# EasyEDA schematic SCH_WROBD 2022_2022-09-23.json
TITLE: Team Prodigy Schematics; REV: 1.0; Date: 2022-09-22; Sheet: 1/1; Drawn By: Tausif Samin; Company: Team Prodigy
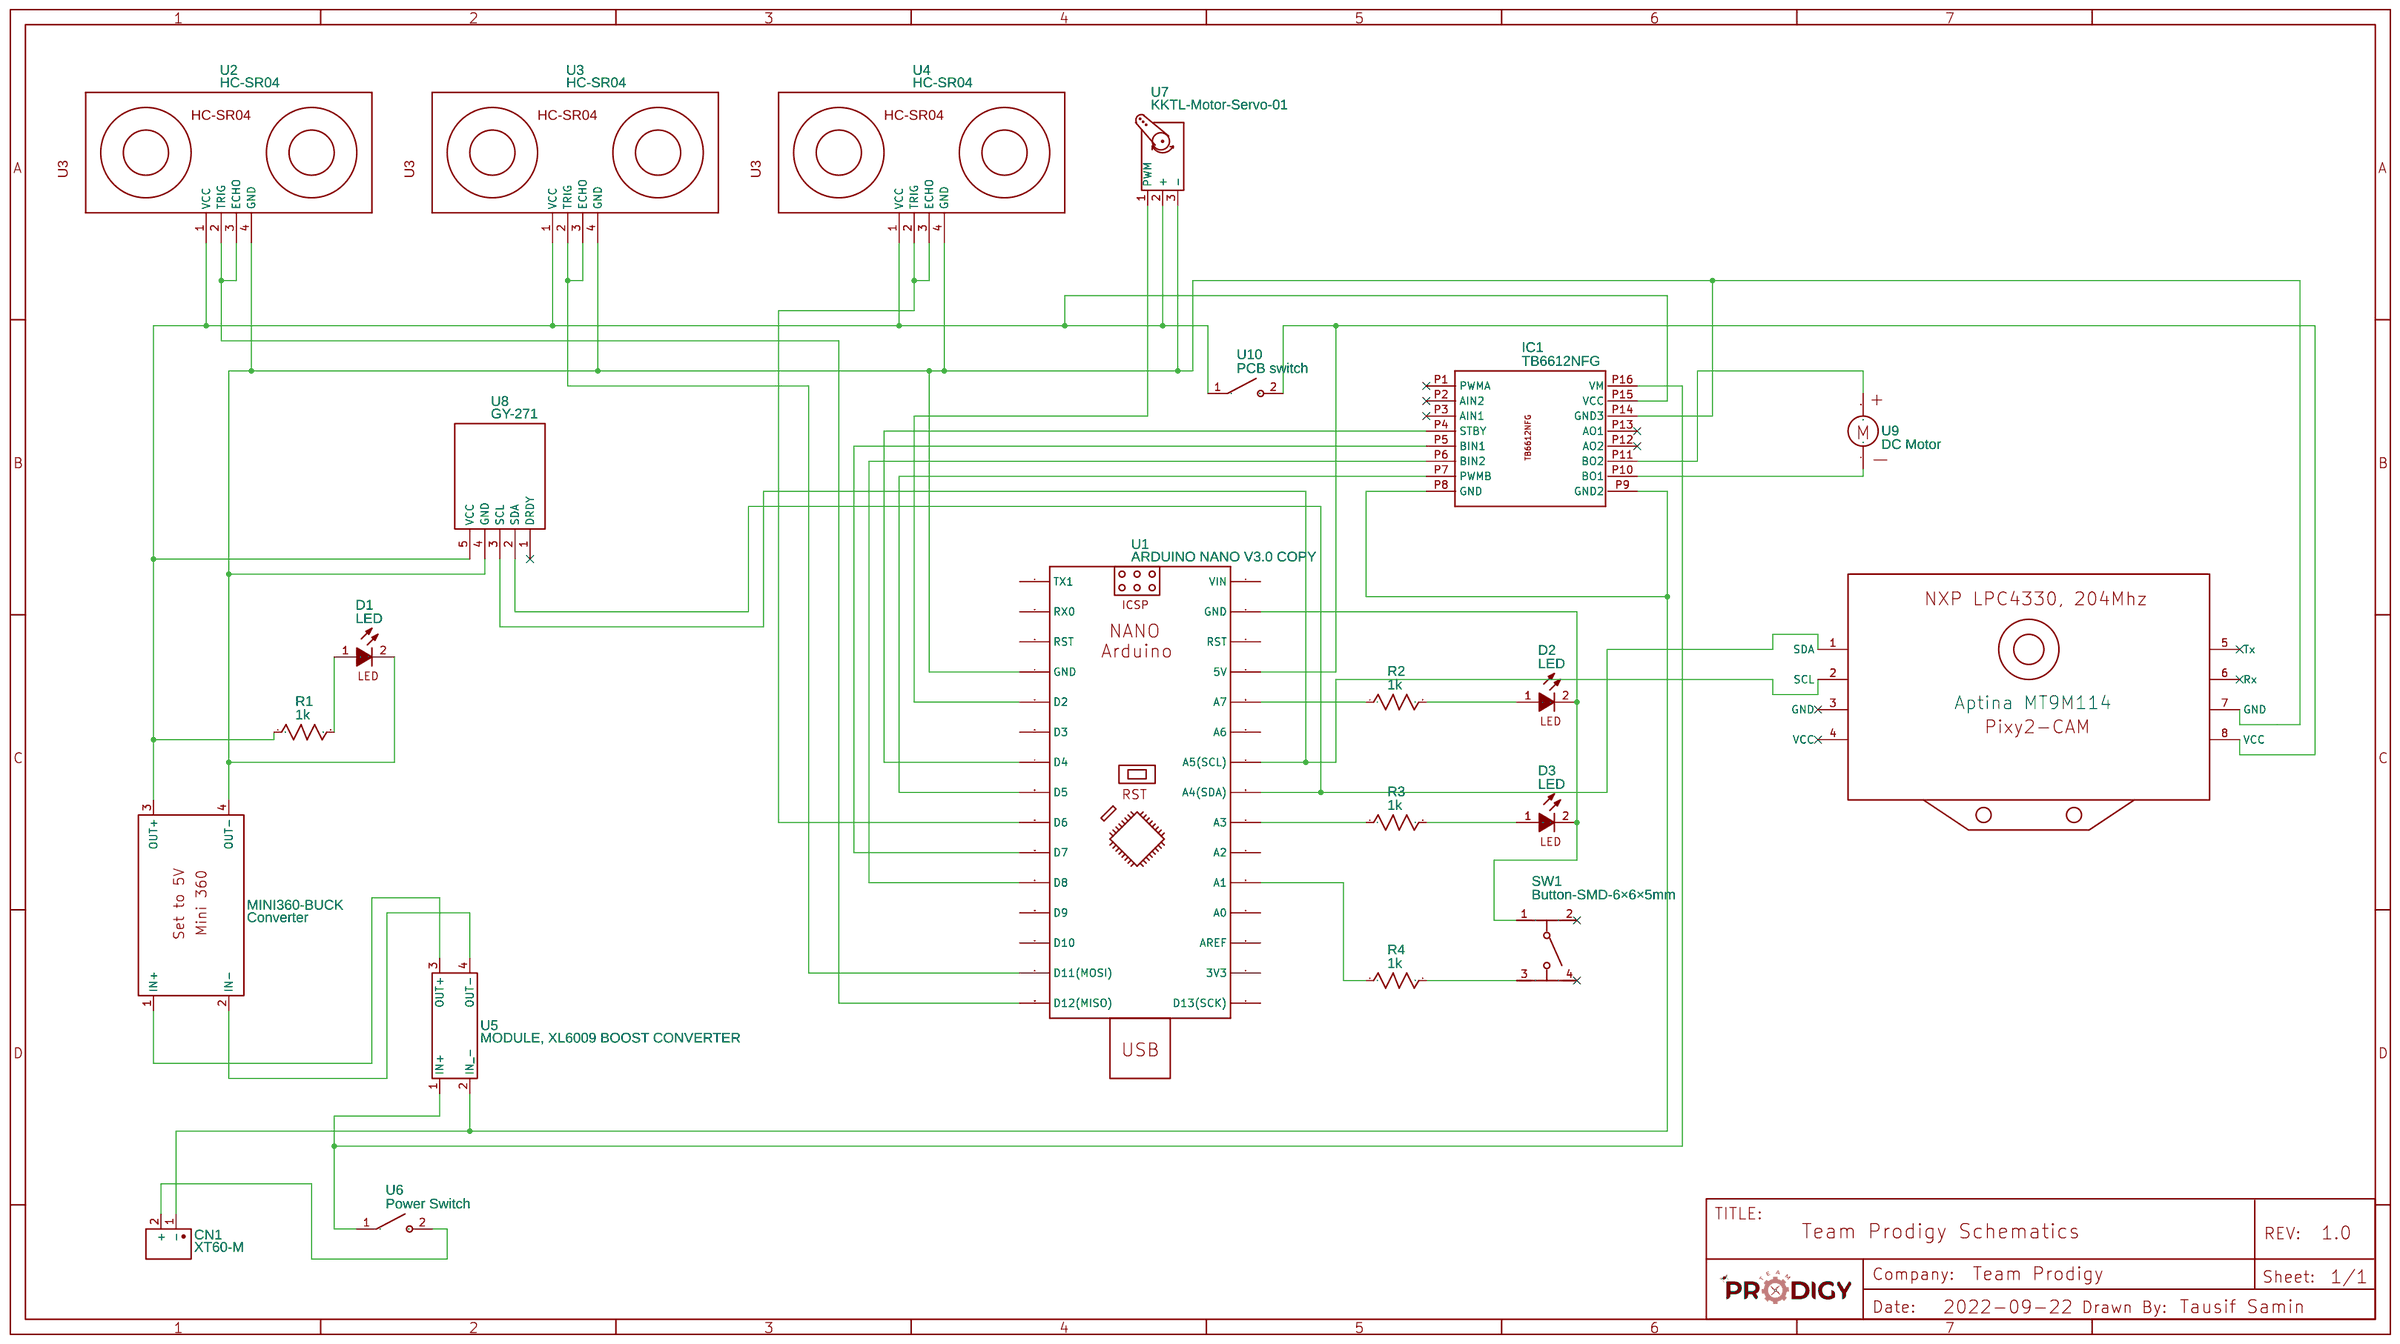
[diagram p0: schematic sheet]

## Parts
CN1  XT60-M  [XT60-M]
D1  LED  [LED-TH_LED-DP2-2LED-AMCC]
D2  LED  [LED-TH_LED-DP2-2LED-AMCC]
D3  LED  [LED-TH_LED-DP2-2LED-AMCC]
IC1  TB6612NFG  [TB6612FNG]
MINI360-BUCK  Converter  [MINI360 BUCKCONVERTER]
R1  1k  [R0603]
R2  1k  [R0603]
R3  1k  [R0603]
R4  1k  [R0603]
SW1  Button-SMD-6×6×5mm  [SW-SMD_4P-L6.0-W6.0-P4.50-LS8.2]
U1  ARDUINO NANO V3.0 COPY  [ARDUINO-NANO-SLS]
U2  HC-SR04  [HC-SR04]
U3  HC-SR04  [HC-SR04]
U4  HC-SR04  [HC-SR04]
U5  MODULE, XL6009 BOOST CONVERTER  [XL6009_BOOST_CONVERTER]
U6  Power Switch  [POWER_SWITCH]
U7  KKTL-Motor-Servo-01  [KKTL-MOTOR-SERVO-01]
U8  GY-271  [HMC5883L_GY271_MODULE]
U9  DC Motor  [TT DC MOTOR]
U10  PCB switch  [POWER_SWITCH]
U11  Huskylens DFRobot with Kendryte210

## Library data of the parts
CN1 = XT60-M: Supplier: LCSC; Supplier Part: C2918078; Manufacturer Part: XT60UPB-M; JLCPCB Part Class: Extended Part; Contributor: LCSC
D1-D3 = LED: Supplier: Digi-Key; Manufacturer: VccLite; Manufacturer Part: 5600; Supplier Part: L20325-ND; link: https://vcclite.com/product/5602f5-5v/; Contributor: robosnake26
IC1 = TB6612NFG: Contributor: John Kana Quispe
MINI360-BUCK = Converter: Manufacturer: JacobsParts; Manufacturer Part: DCMOD-H; Supplier: Amazon; Supplier Part: B078C7ZS74; link: https://smile.amazon.com/gp/product/B078C7ZS74/ref=ppx_yo_dt_b_asin_title_o06_s00?ie=UTF8&th=1; Contributor: bniester
R1-R4 = R_0603_US: Contributor: LCEDA_Lib
SW1 = Button-SMD-6×6×5mm: Supplier: LCSC; Manufacturer: ReliaPro; Manufacturer Part: 6×6×5mm RHOS; Supplier Part: C21456; JLCPCB Part Class: Extended Part
U1 = ARDUINO NANO V3.0 COPY: Supplier: AliExpres; Supplier Part: XC4414; link: https://www.jaycar.com.au/duinotech-nano-board-arduino-compatible/p/XC4414; Contributor: director31
U2-U4 = HC-SR04: Manufacturer Part: ServoMotor; Contributor: srimbey
U5 = MODULE, XL6009 BOOST CONVERTER: Supplier: LCSC; Supplier Part: C2908146; Manufacturer: null; Manufacturer Part: xl6009模块; JLCPCB Part Class: Extended Part; Contributor: victorbramhall
U6 U10 = PCB switch: Supplier Part: C118141; Contributor: LCEDA_Lib
U7 = KKTL-Motor-Servo-01: Contributor: kakatuland
U8 = GY-271: Contributor: exersizze; sourceId: G2Wd7pHZT
U9 = DC Motor: Contributor: MARTINbucke
U11 = Huskylens DFRobot with Kendryte210: Contributor: Boibelo

## Nets
Net-(CN1-1): CN1.1(-) IC1.P8(GND) IC1.P9(GND2) U5.2(IN -)
Net-(CN1-2): CN1.2(+) U6.2
Net-(D1-1): D1.1(A) R1.2
Net-(D1-2): D1.2(K) IC1.P14(GND3) MINI360-BUCK.4(OUT-) U1.4(GND) U2.4(GND) U3.4(GND) U4.4(GND) U7.3(-) U8.4(GND)
Net-(D2-1): D2.1(A) R2.2
Net-(D2-2): D2.2(K) D3.2(K) SW1.1 U1.29(GND)
Net-(D3-1): D3.1(A) R3.2
Net-(IC1-P4): IC1.P4(STBY) U1.7(D4)
Net-(IC1-P5): IC1.P5(BIN1) U1.10(D7)
Net-(IC1-P6): IC1.P6(BIN2) U1.11(D8)
Net-(IC1-P7): IC1.P7(PWMB) U1.8(D5)
Net-(IC1-P10): IC1.P10(BO1) U9.1
Net-(IC1-P11): IC1.P11(BO2) U9.2
Net-(IC1-P15): IC1.P15(VCC) MINI360-BUCK.3(OUT+) R1.1 U2.1(VCC) U3.1(VCC) U4.1(VCC) U7.2(+) U8.5(VCC) U10.1
Net-(IC1-P16): IC1.P16(VM) U5.1(IN+) U6.1
Net-(MINI360-BUCK-1): MINI360-BUCK.1(IN+) U5.3(OUT+)
Net-(MINI360-BUCK-2): MINI360-BUCK.2(IN-) U5.4(OUT-)
Net-(R2-1): R2.1 U1.26(A7)
Net-(R3-1): R3.1 U1.22(A3)
Net-(R4-1): R4.1 U1.20(A1)
Net-(R4-2): R4.2 SW1.3
Net-(U1-5): U1.5(D2) U7.1(PWM)
Net-(U1-9): U1.9(D6) U4.2(TRIG) U4.3(ECHO)
Net-(U1-14): U1.14(D11(MOSI)) U3.2(TRIG) U3.3(ECHO)
Net-(U1-15): U1.15(D12(MISO)) U2.2(TRIG) U2.3(ECHO)
Net-(U1-23): U1.23(A4(SDA)) U8.2(SDA)
Net-(U1-24): U1.24(A5(SCL)) U8.3(SCL)
Net-(U1-27): U1.27(5V) U10.2

Not connected (* = marked no-connect by the designer): IC1 P1(PWMA)* P2(AIN2)* P3(AIN1)* P12(AO2)* P13(AO1)*; SW1 2* 4*; U1 1(TX1) 2(RX0) 3(RST) 6(D3) 12(D9) 13(D10) 16(D13(SCK)) 17(3V3) 18(AREF) 19(A0) 21(A2) 25(A6) 28(RST) 30(VIN); U8 1(DRDY)*; U11 1(SDA) 2(SCL) 3(GND) 4(VCC) 5(Tx) 6(Rx) 7(GND) 8(VCC)

## Notes on the sheet
- Aptina MT9M114
